# EAGLE design Anatidae (EAGLE 5.11)
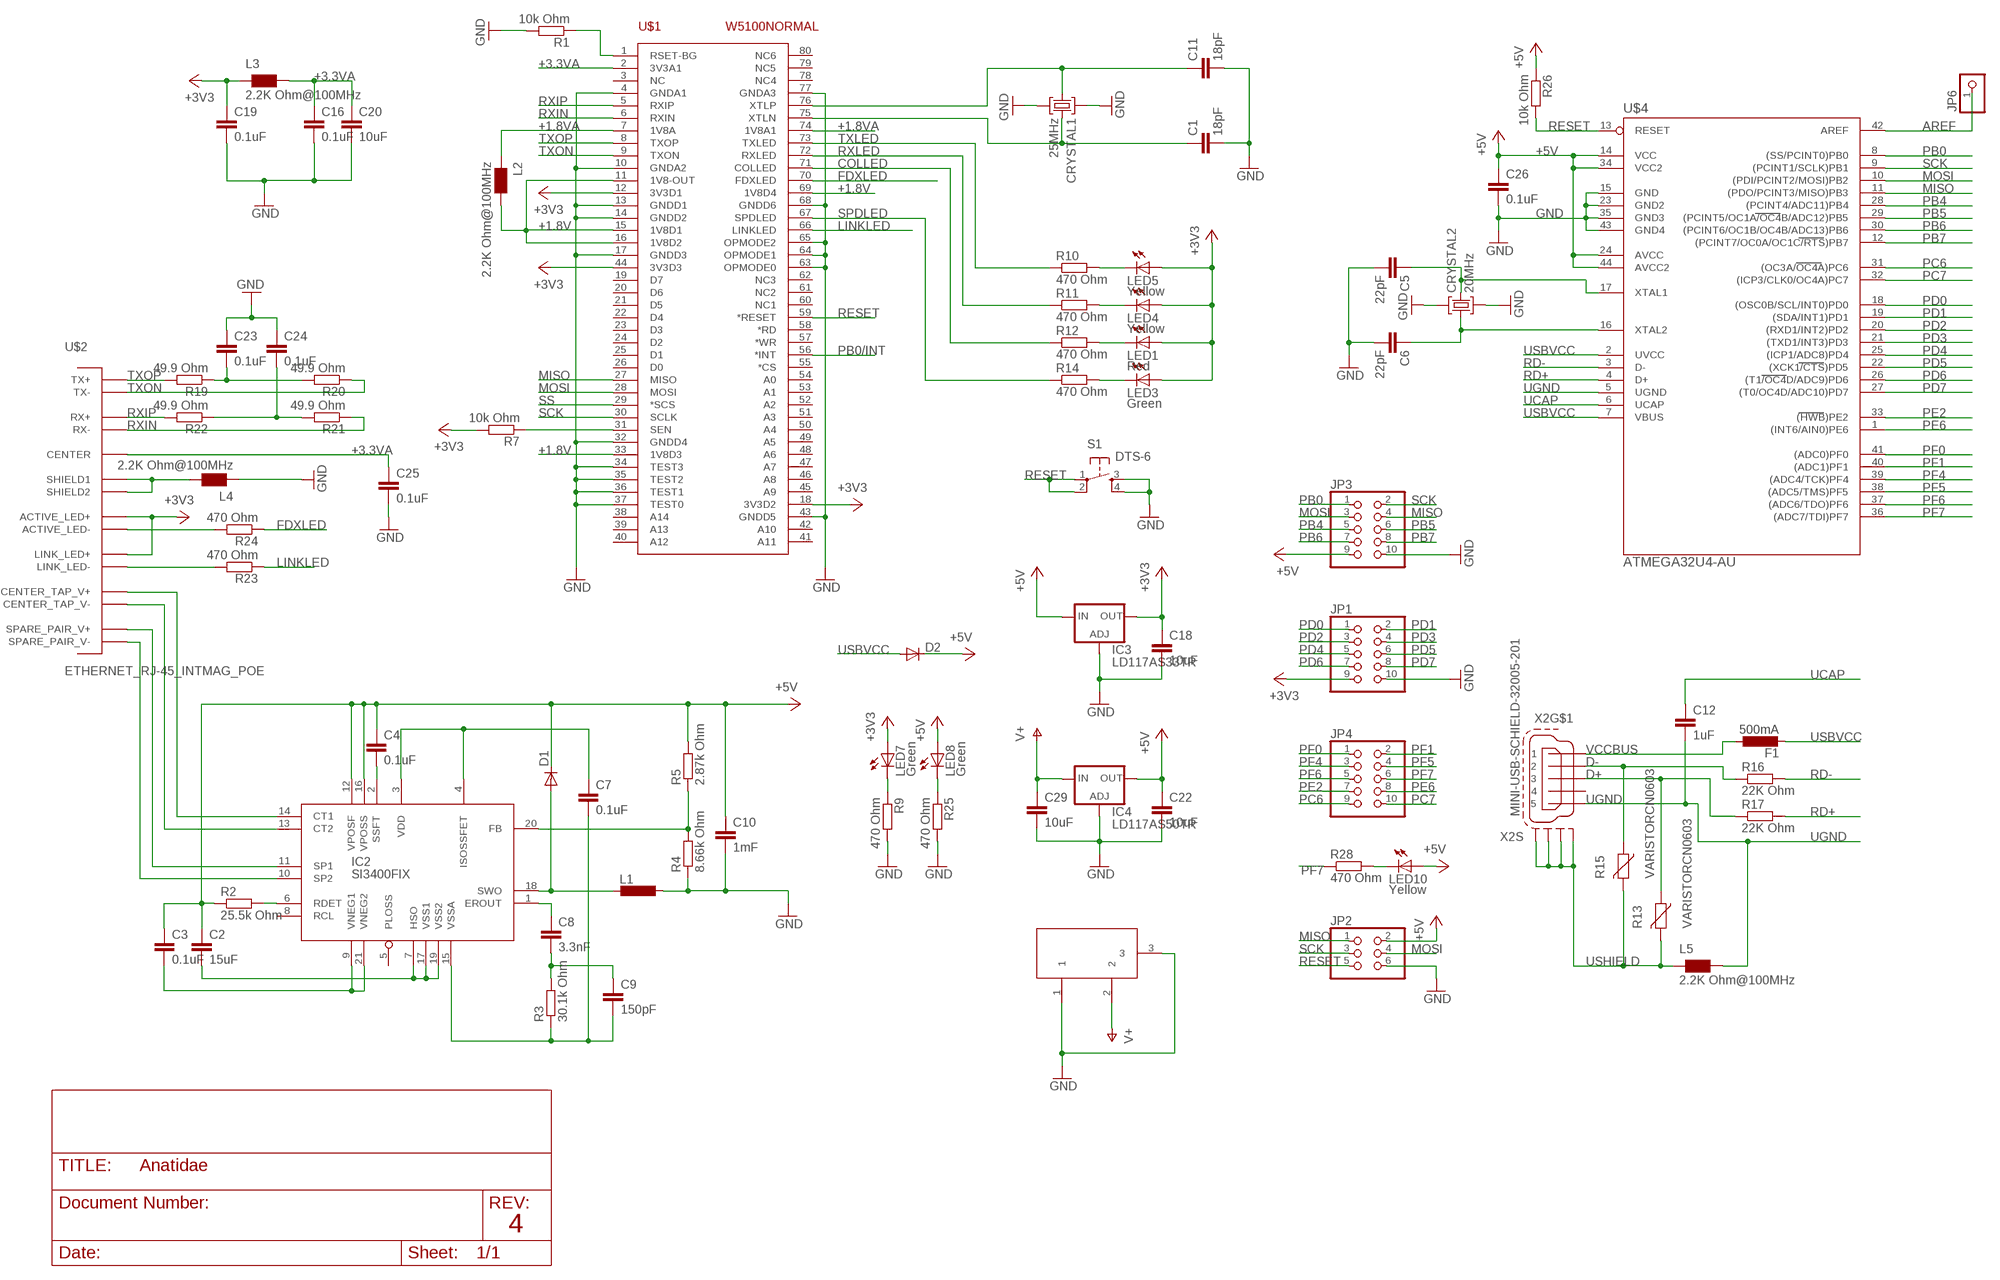
[diagram p0: schematic, sheet 1]

## Parts
C1  18pF  C-EUC0603  [C0603]
C2  15uF  C-EUC0603  [C0603]
C3  0.1uF  C-EUC0603  [C0603]
C4  0.1uF  C-EUC0603  [C0603]
C5  22pF  C-EUC0603  [C0603]
C6  22pF  C-EUC0603  [C0603]
C7  0.1uF  C-EUC0603  [C0603]
C8  3.3nF  C-EUC0603  [C0603]
C9  150pF  C-EUC0603  [C0603]
C10  1mF  C-EUC0603  [C0603]
C11  18pF  C-EUC0603  [C0603]
C12  1uF  C-EUC0603  [C0603]
C16  0.1uF  C-EUC0603  [C0603]
C18  10uF  C-EUC1210  [C1210]
C19  0.1uF  C-EUC0603  [C0603]
C20  10uF  C-EUC1210  [C1210]
C22  10uF  C-EUC1210  [C1210]
C23  0.1uF  C-EUC0603  [C0603]
C24  0.1uF  C-EUC0603  [C0603]
C25  0.1uF  C-EUC0603  [C0603]
C26  0.1uF  C-EUC0603  [C0603]
C29  10uF  C-EUC1210  [C1210]
CRYSTAL1  25MHz  MJ-CRYSTAL  [5032]
CRYSTAL2  20MHz  MJ-CRYSTAL  [5032]
D1  DIODESMA  [SMA-DIODE]
D2  DIODESMA  [SMA-DIODE]
F1  500mA  L-EUL1812  [L1812]
IC2  SI3400FIX  [QFN-20-FIX]
IC3  LD117AS33TR  [SOT223]
IC4  LD117AS50TR  [SOT223]
JP1  PINHD-2X5  [2X05]
JP2  PINHD-2X3  [2X03]
JP3  PINHD-2X5  [2X05]
JP4  PINHD-2X5  [2X05]
JP6  PINHD-1X1  [1X01]
L1  L-EUL1812  [L1812]
L2  2.2K Ohm@100MHz  WE-CBF_0603  [0603]
L3  2.2K Ohm@100MHz  WE-CBF_0603  [0603]
L4  2.2K Ohm@100MHz  WE-CBF_0603  [0603]
L5  2.2K Ohm@100MHz  WE-CBF_0603  [0603]
LED1  Red  LEDCHIP-LED0603  [CHIP-LED0603]
LED3  Green  LEDCHIP-LED0603  [CHIP-LED0603]
LED4  Yellow  LEDCHIP-LED0603  [CHIP-LED0603]
LED5  Yellow  LEDCHIP-LED0603  [CHIP-LED0603]
LED7  Green  LEDCHIP-LED0603  [CHIP-LED0603]
LED8  Green  LEDCHIP-LED0603  [CHIP-LED0603]
LED10  Yellow  LEDCHIP-LED0603  [CHIP-LED0603]
R1  10k Ohm  R-EU_R0603  [R0603]
R2  25.5k Ohm  R-EU_R0603  [R0603]
R3  30.1k Ohm  R-EU_R0603  [R0603]
R4  8.66k Ohm  R-EU_R0603  [R0603]
R5  2.87k Ohm  R-EU_R0603  [R0603]
R7  10k Ohm  R-EU_R0603  [R0603]
R9  470 Ohm  R-EU_R0603  [R0603]
R10  470 Ohm  R-EU_R0603  [R0603]
R11  470 Ohm  R-EU_R0603  [R0603]
R12  470 Ohm  R-EU_R0603  [R0603]
R13  VARISTORCN0603  [CT/CN0603]
R14  470 Ohm  R-EU_R0603  [R0603]
R15  VARISTORCN0603  [CT/CN0603]
R16  22K Ohm  R-EU_R0603  [R0603]
R17  22K Ohm  R-EU_R0603  [R0603]
R19  49.9 Ohm  R-EU_R0603  [R0603]
R20  49.9 Ohm  R-EU_R0603  [R0603]
R21  49.9 Ohm  R-EU_R0603  [R0603]
R22  49.9 Ohm  R-EU_R0603  [R0603]
R23  470 Ohm  R-EU_R0603  [R0603]
R24  470 Ohm  R-EU_R0603  [R0603]
R25  470 Ohm  R-EU_R0603  [R0603]
R26  10k Ohm  R-EU_R0603  [R0603]
R28  470 Ohm  R-EU_R0603  [R0603]
S1  DTS-6  [DTS-6]
U$1  W5100NORMAL  [W5100]
U$2  ETHERNET_RJ-45_INTMAG_POE  [ETHERNET_RJ-45_INTMAG_POE]
U$4  ATMEGA32U4-AU  [TQFP44]
U$6  POWERSUPPLY_DC21MMX  [POWERSUPPLY_DC-21MM]
X2  MINI-USB-SCHIELD-32005-201  [32005-201]

## Nets
+1.8V: L2.2 U$1.11(1V8-OUT) U$1.15(1V8D1) U$1.16(1V8D2) U$1.33(1V8D3) U$1.69(1V8D4)
+1.8VA: L2.1 U$1.7(1V8A) U$1.74(1V8A1)
+3.3VA: C16.1 C20.1 C25.1 L3.2 U$1.2(3V3A1) U$2.CENTER
+3V3: C18.1 C19.1 IC3.4(OUT) JP1.9 L3.1 LED1.A LED3.A LED4.A LED5.A LED7.A R7.2 U$1.12(3V3D1) U$1.18(3V3D2) U$1.44(3V3D3) U$2.ACTIVE_LED+ U$2.LINK_LED+
+5V: C2.1 C3.1 C4.1 C10.1 C22.1 C26.1 D1.C D2.C IC2.12(VPOSF) IC2.16(VPOSS) IC3.3(IN) IC4.4(OUT) JP2.2 JP3.9 LED8.A LED10.A R2.1 R5.2 R26.1 U$4.14(VCC) U$4.24(AVCC) U$4.34(VCC2) U$4.44(AVCC2)
AREF: JP6.1 U$4.42(AREF)
COLLED: R12.1 U$1.71(COLLED)
D+: R13.1 R17.1 X2.3
D-: R15.1 R16.1 X2.2
FDXLED: R24.1 U$1.70(FDXLED)
GND: C1.2 C5.2 C6.2 C10.2 C11.2 C16.2 C18.2 C19.2 C20.2 C22.2 C23.1 C24.1 C25.2 C26.2 C29.2 CRYSTAL1.2-G CRYSTAL1.4-G CRYSTAL2.2-G CRYSTAL2.4-G IC3.1(ADJ) IC4.1(ADJ) JP1.10 JP2.6 JP3.10 L1.1 L4.1 R1.2 R4.1 R9.2 R25.2 S1.3 S1.4 U$1.4(GNDA1) U$1.10(GNDA2) U$1.13(GNDD1) U$1.14(GNDD2) U$1.17(GNDD3) U$1.32(GNDD4) U$1.34(TEST3) U$1.35(TEST2) U$1.36(TEST1) U$1.37(TEST0) U$1.43(GNDD5) U$1.63(OPMODE0) U$1.64(OPMODE1) U$1.65(OPMODE2) U$1.68(GNDD6) U$1.77(GNDA3) U$4.15(GND) U$4.23(GND2) U$4.35(GND3) U$4.43(GND4) U$6.1 U$6.3
LINKLED: R23.1 U$1.66(LINKLED)
MISO: JP2.1 JP3.4 U$1.27(MISO) U$4.11((PDO/PCINT3/MISO)PB3)
MOSI: JP2.4 JP3.3 U$1.28(MOSI) U$4.10((PDI/PCINT2/MOSI)PB2)
N$1: C6.1 CRYSTAL2.1-C U$4.16(XTAL2)
N$2: C5.1 CRYSTAL2.3-C U$4.17(XTAL1)
N$3: IC2.14(CT1) U$2.CENTER_TAP_V+
N$4: IC2.13(CT2) U$2.CENTER_TAP_V-
N$5: IC2.11(SP1) U$2.SPARE_PAIR_V+
N$6: IC2.10(SP2) U$2.SPARE_PAIR_V-
N$7: IC2.6(RDET) R2.2
N$8: R1.1 U$1.1(RSET-BG)
N$9: C3.2 IC2.9(VNEG1) IC2.21(VNEG2)
N$10: C4.2 IC2.2(SSFT)
N$11: C7.1 IC2.3(VDD) IC2.4(ISOSSFET)
N$12: C2.2 IC2.7(HSO) IC2.17(VSS1) IC2.19(VSS2)
N$13: C7.2 C9.2 IC2.15(VSSA) R3.1
N$14: C8.2 C9.1 R3.2
N$15: C8.1 IC2.1(EROUT)
N$16: IC2.20(FB) R4.2 R5.1
N$17: D1.A IC2.18(SWO) L1.2
N$19: C11.1 CRYSTAL1.1-C U$1.76(XTLP)
N$20: C1.1 CRYSTAL1.3-C U$1.75(XTLN)
N$21: LED7.C R9.1
N$22: LED5.C R10.2
N$23: R7.1 U$1.31(SEN)
N$24: LED4.C R11.2
N$25: LED1.C R12.2
N$27: LED3.C R14.2
N$36: L4.2 U$2.SHIELD1 U$2.SHIELD2
N$37: R23.2 U$2.LINK_LED-
N$38: R24.2 U$2.ACTIVE_LED-
N$39: LED8.C R25.1
N$41: C23.2 R19.1 R20.2
N$42: C24.2 R21.2 R22.1
N$59: LED10.C R28.2
PB0: JP3.1 U$4.8((SS/PCINT0)PB0)
PB0/INT: U$1.56(*INT)
PB4: JP3.5 U$4.28((PCINT4/ADC11)PB4)
PB5: JP3.6 U$4.29((PCINT5/OC1A/OC4B/ADC12)PB5)
PB6: JP3.7 U$4.30((PCINT6/OC1B/OC4B/ADC13)PB6)
PB7: JP3.8 U$4.12((PCINT7/OC0A/OC1C/RTS)PB7)
PC6: JP4.9 U$4.31((OC3A/OC4A)PC6)
PC7: JP4.10 U$4.32((ICP3/CLK0/OC4A)PC7)
PD0: JP1.1 U$4.18((OSC0B/SCL/INT0)PD0)
PD1: JP1.2 U$4.19((SDA/INT1)PD1)
PD2: JP1.3 U$4.20((RXD1/INT2)PD2)
PD3: JP1.4 U$4.21((TXD1/INT3)PD3)
PD4: JP1.5 U$4.25((ICP1/ADC8)PD4)
PD5: JP1.6 U$4.22((XCK1/CTS)PD5)
PD6: JP1.7 U$4.26((T1/OC4D/ADC9)PD6)
PD7: JP1.8 U$4.27((T0/OC4D/ADC10)PD7)
PE2: JP4.7 U$4.33((HWB)PE2)
PE6: JP4.8 U$4.1((INT6/AIN0)PE6)
PF0: JP4.1 U$4.41((ADC0)PF0)
PF1: JP4.2 U$4.40((ADC1)PF1)
PF4: JP4.3 U$4.39((ADC4/TCK)PF4)
PF5: JP4.4 U$4.38((ADC5/TMS)PF5)
PF6: JP4.5 U$4.37((ADC6/TDO)PF6)
PF7: JP4.6 R28.1 U$4.36((ADC7/TDI)PF7)
RD+: R17.2 U$4.4(D+)
RD-: R16.2 U$4.3(D-)
RESET: JP2.5 R26.2 S1.1 S1.2 U$1.59(*RESET) U$4.13(RESET)
RXIN: R21.1 U$1.6(RXIN) U$2.RX-
RXIP: R22.2 U$1.5(RXIP) U$2.RX+
RXLED: R11.1 U$1.72(RXLED)
SCK: JP2.3 JP3.2 U$1.30(SCLK) U$4.9((PCINT1/SCLK)PB1)
SPDLED: R14.1 U$1.67(SPDLED)
SS: U$1.29(*SCS)
TXLED: R10.1 U$1.73(TXLED)
TXON: R20.1 U$1.9(TXON) U$2.TX-
TXOP: R19.2 U$1.8(TXOP) U$2.TX+
UCAP: C12.1 U$4.6(UCAP)
UGND: C12.2 L5.2 U$4.5(UGND) X2.5
USBVCC: D2.A F1.2 U$4.2(UVCC) U$4.7(VBUS)
USHIELD: L5.1 R13.2 R15.2 X2.M1(S:S1) X2.M2(S:S2) X2.M3(S:S3) X2.M4(S:S4)
V+: C29.1 IC4.3(IN) U$6.2
VCCBUS: F1.1 X2.1
Unconnected: IC2.5(PLOSS) IC2.8(RCL) U$1.3(NC) U$1.19(D7) U$1.20(D6) U$1.21(D5) U$1.22(D4) U$1.23(D3) U$1.24(D2) U$1.25(D1) U$1.26(D0) U$1.38(A14) U$1.39(A13) U$1.40(A12) U$1.41(A11) U$1.42(A10) U$1.45(A9) U$1.46(A8) U$1.47(A7) U$1.48(A6) U$1.49(A5) U$1.50(A4) U$1.51(A3) U$1.52(A2) U$1.53(A1) U$1.54(A0) U$1.55(*CS) U$1.57(*WR) U$1.58(*RD) U$1.60(NC1) U$1.61(NC2) U$1.62(NC3) U$1.78(NC4) U$1.79(NC5) U$1.80(NC6) X2.4

## Notes on the sheet
- 4

## Library data of the parts
C1-C12 C16 C18-C20 C22-C26 C29 = rcl:C-EU: CAPACITOR, European symbol
CRYSTAL1 CRYSTAL2 = crystals:MJ-CRYSTAL: EURO QUARTZ MJ CRYSTALS 5 x 3.2 x 1.0mm SMD
D1 D2 = SparkFun:DIODE: Diode These are standard reverse protection diodes and small signal diodes. SMA package can handle up to about 1A. SOD-323 can handle about 200mA. What the SOD-323 package when ordering, there are some mfgs out there that are 5-pin packages.
F1 L1 = rcl:L-EU: INDUCTOR, European symbol
IC2 = silabs-eth:SI3400: Si3400 Power-over-Ethernet (PoE)
IC3 IC4 = v-reg:LD117A?*: Low drop fixed and adjustable positive voltage regulators 1 A Source: http://www.st.com/stonline/products/literature/ds/7194/ld1117axx.pdf
JP1 JP3 JP4 = pinhead:PINHD-2X5: PIN HEADER
JP2 = pinhead:PINHD-2X3: PIN HEADER
JP6 = pinhead:PINHD-1X1: PIN HEADER
L2-L5 = wuerth-elektronik:WE-CBF: SMD EMI Suppression Ferrite Beads - excellent anti-EMI properties - low DCR - impedances till 3000 ohms - rated current up to 6 A
LED1 LED3-LED5 LED7 LED8 LED10 = led:LED: LED OSRAM: - CHIPLED LG R971, LG N971, LY N971, LG Q971, LY Q971, LO R971, LY R971 LH N974, LH R974 LS Q976, LO Q976, LY Q976 LO Q996 - Hyper CHIPLED LW Q18S LB Q993, LB Q99A, LB R99A - SideLED LS A670, LO A670, LY A670, LG A670, LP A670 LB A673, LV A673, LT A673, LW A673 LH A674 LY A675 LS A676, LA A676, LO A676, LY A676, LW A676 LS A679, LY A679, LG A679 - Hyper Micro SIDELED® LS Y876, LA Y876, LO Y876, LY Y876 LT Y87S - SmartLED LW L88C, LW L88S LB L89C, LB L89S, LG L890 LS L89K, LO L89K, LY L89K LS L896, LA L896, LO L896, LY L896 - TOPLED LS T670, LO T670, LY T670, LG T670, LP T670 LSG T670, LSP T670, LSY T670, LOP T670, LYG T670 LG T671, LOG T671, LSG T671 LB T673, LV T673, LT T673, LW T673 LH T674 LS T676, LA T676, LO T676, LY T676, LB T676, LH T676, LSB T676, LW T676 LB T67C, LV T67C, LT T67C, LS T67K, LO T67K, LY T67K, LW E67C LS E67B, LA E67B, LO E67B, LY E67B, LB E67C, LV E67C, LT E67C LW T67C LS T679, LY T679, LG T679 LS T770, LO T770, LY T770, LG T770, LP T770 LB T773, LV T773, LT T773, LW T773 LH T774 LS E675, LA E675, LY E675, LS T675 LS T776, LA T776, LO T776, LY T776, LB T776 LHGB T686 LT T68C, LB T68C - Hyper Mini TOPLED® LB M676 - Mini TOPLED Santana® LG M470 LS M47K, LO M47K, LY M47K Source: http://www.osram.convergy.de LUXEON: - LUMILED® LXK2-PW12-R00, LXK2-PW12-S00, LXK2-PW14-U00, LXK2-PW14-V00 LXK2-PM12-R00, LXK2-PM12-S00, LXK2-PM14-U00 LXK2-PE12-Q00, LXK2-PE12-R00, LXK2-PE12-S00, LXK2-PE14-T00, LXK2-PE14-U00 LXK2-PB12-K00, LXK2-PB12-L00, LXK2-PB12-M00, LXK2-PB14-N00, LXK2-PB14-P00, LXK2-PB14-Q00 LXK2-PR12-L00, LXK2-PR12-M00, LXK2-PR14-Q00, LXK2-PR14-R00 LXK2-PD12-Q00, LXK2-PD12-R00, LXK2-PD12-S00 LXK2-PH12-R00, LXK2-PH12-S00 LXK2-PL12-P00, LXK2-PL12-Q00, LXK2-PL12-R00 Source: www.luxeon.com KINGBRIGHT: KA-3528ASYC Source: www.kingbright.com
R1-R5 R7 R9-R12 R14 R16 R17 R19-R26 R28 = rcl:R-EU_: RESISTOR, European symbol
R13 R15 = varistor:VARISTOR: VARISTOR
S1 = switch:DTS-6
U$1 = WIZNET:W5100: W5100 single-chip Internet-enabled 10/100 Ethernet controller The W5100 is a full-featured, single-chip Internet-enabled 10/100 Ethernet controller designed for embedded applications where ease of integration, stability, performance, area and system cost control are required. The W5100 has been designed to facilitate easy implementation of Internet connectivity without OS. The W5100 is IEEE 802.3 10BASE-T and 802.3u 100BASE-TX compliant.
U$2 = connector:ETHERNET_RJ-45_INTMAG_POE: Ethernet Jack with Integrated Magnetics and Power over Ethernet Single RJ-45 "MagJack" with integrated magnetics and LEDs. 10/100 Base with Power over Ethernet.
U$4 = mega32U4:ATMEGA32U4-AU
U$6 = Sparky:POWERSUPPLY_DC21MM
X2 = con-cypressindustries:MINI-USB-SCHIELD-: MINI USB-B Conector Source: www.cypressindustries.com; OC_FARNELL: unknown; OC_NEWARK: unknown

## Board
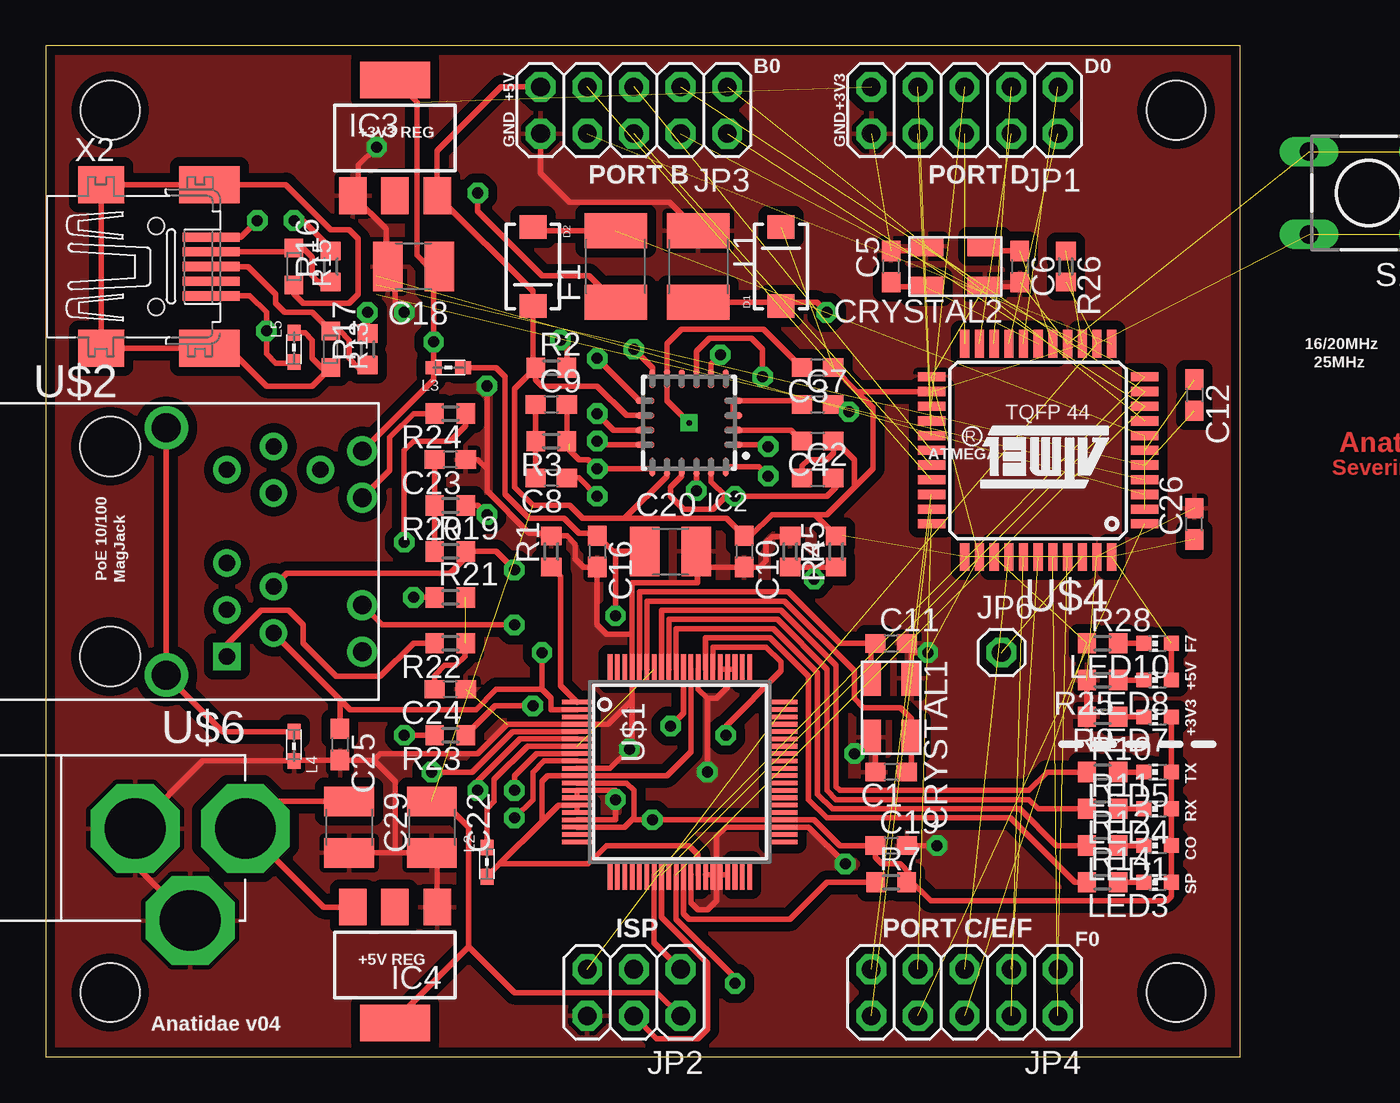
[diagram p1: board, top side]
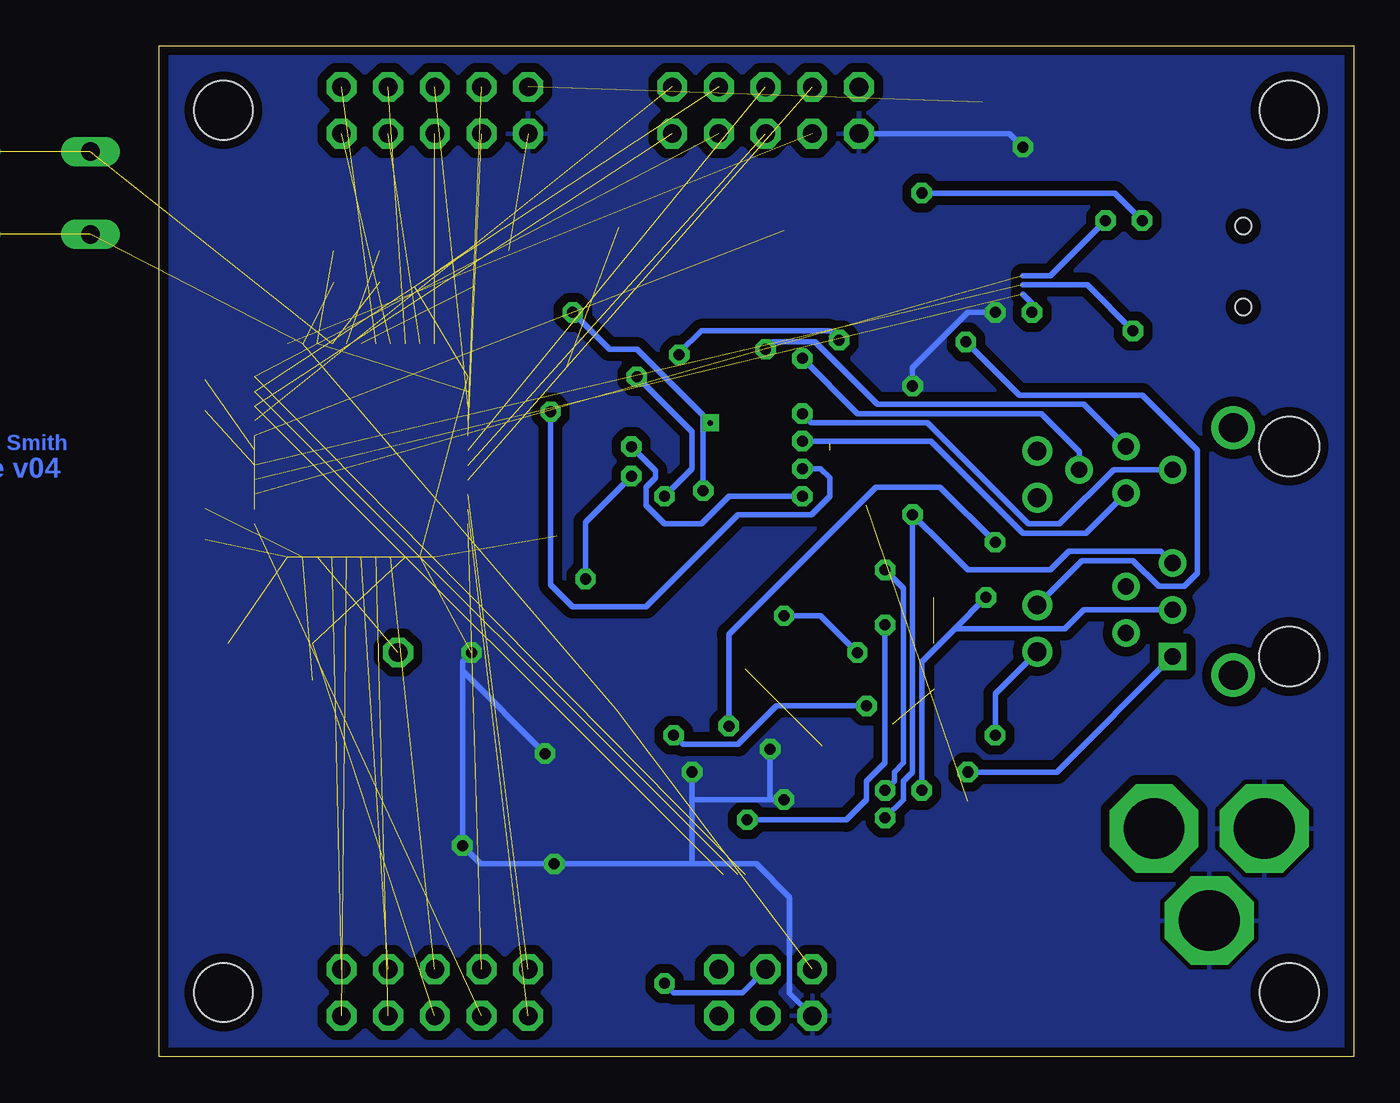
[diagram p2: board, bottom side, seen from below]

Size 65 x 55 mm. Coordinates in mm from the lower left corner, seen from the top.
Outline: 0,0 65,0 65,55 0,55 0,0
Copper layers (1*16): Top 0.035mm / dielectric 1.5mm / Bottom 0.035mm
Design rules "APC": minimum track width 7mil, minimum drill 20mil, track to track 7mil, track to pad 7mil, pad to pad 7mil, via to via 7mil, smd to smd 0mil, copper to edge 8mil, drill to drill 8mil, minimum pad ring 12mil, minimum via ring 10mil, stop-mask expansion 4mil, vias tented up to drill 25mil, thermal gap 10mil
Holes 3.2 mm at 3.5,3.5 3.5,51.5 61.5,51.5 61.5,3.5
tRestrict: area 73.5,18.5 to 76.5,21.5; area 68.2,31 to 80.2,34.5
bRestrict: area 68.2,31 to 80.2,34.5

### Footprints (pad centres in the part's own frame; a part is rotated, then mirrored left to right if it is on the bottom)
C0603 = smd 1.1 x 1: 1 -0.85,0; 2 0.85,0
C1210 = smd 1.6 x 2.7: 1 -1.4,0; 2 1.4,0
5032 = smd 1.9 x 1.1: 1-C -1.6,-1.1; 2-G 1.6,-1.1; 3-C 1.6,1.1; 4-G -1.6,1.1
SMA-DIODE = smd 1.27 x 1.47: A -2.15,0; C 2.15,0
L1812 = smd 1.9 x 3.4: 1 -1.95,0; 2 1.95,0
QFN-20-FIX = smd 1 x 0.35: 1 -2.4,1.2; 2 -2.4,0.4; 3 -2.4,-0.4; 4 -2.4,-1.2; 11 2.4,-1.2; 12 2.4,-0.4; 13 2.4,0.4; 14 2.4,1.2 | smd 0.35 x 1: 5 -2,-2.4; 6 -1.2,-2.4; 7 -0.4,-2.4; 8 0.4,-2.4; 9 1.2,-2.4; 10 2,-2.4; 15 2,2.4; 16 1.2,2.4; 17 0.4,2.4; 18 -0.4,2.4; 19 -1.2,2.4; 20 -2,2.4 | drill 0.3 pad 0.75 square: 21 0,0
SOT223 = smd 1.5 x 2: 1 -2.3,-3.15; 2 0,-3.15; 3 2.3,-3.15 | smd 3.8 x 2: 4 0,3.15
2X05 = drill 1.016 octagon: 1 -5.08,-1.27; 2 -5.08,1.27; 3 -2.54,-1.27; 4 -2.54,1.27; 5 0,-1.27; 6 0,1.27; 7 2.54,-1.27; 8 2.54,1.27; 9 5.08,-1.27; 10 5.08,1.27
2X03 = drill 1.016 octagon: 1 -2.54,-1.27; 2 -2.54,1.27; 3 0,-1.27; 4 0,1.27; 5 2.54,-1.27; 6 2.54,1.27
1X01 = drill 1.016 octagon: 1 0,0
0603 = smd 0.85 x 0.7: 1 -0.9,0; 2 0.7,0
CHIP-LED0603 = smd 0.8 x 0.8: A 0,-0.75; C 0,0.75
R0603 = smd 1 x 1.1: 1 -0.85,0; 2 0.85,0
CT/CN0603 = smd 1 x 1: 1 -1,0; 2 1,0
DTS-6 = drill 1 long: 1 -3.25,2.25; 2 3.25,2.25; 3 -3.25,-2.25; 4 3.25,-2.25
W5100 = smd 0.25 x 1.6: 1 -3.8,-5.6; 2 -3.4,-5.6; 3 -3,-5.6; 4 -2.6,-5.6; 5 -2.2,-5.6; 6 -1.8,-5.6; 7 -1.4,-5.6; 8 -1,-5.6; 9 -0.6,-5.6; 10 -0.2,-5.6; 11 0.2,-5.6; 12 0.6,-5.6; 13 1,-5.6; 14 1.4,-5.6; 15 1.8,-5.6; 16 2.2,-5.6; 17 2.6,-5.6; 18 3,-5.6; 19 3.4,-5.6; 20 3.8,-5.6; 41 3.8,5.6; 42 3.4,5.6; 43 3,5.6; 44 2.6,5.6; 45 2.2,5.6; 46 1.8,5.6; 47 1.4,5.6; 48 1,5.6; 49 0.6,5.6; 50 0.2,5.6; 51 -0.2,5.6; 52 -0.6,5.6; 53 -1,5.6; 54 -1.4,5.6; 55 -1.8,5.6; 56 -2.2,5.6; 57 -2.6,5.6; 58 -3,5.6; 59 -3.4,5.6; 60 -3.8,5.6 | smd 1.6 x 0.25: 21 5.6,-3.8; 22 5.6,-3.4; 23 5.6,-3; 24 5.6,-2.6; 25 5.6,-2.2; 26 5.6,-1.8; 27 5.6,-1.4; 28 5.6,-1; 29 5.6,-0.6; 30 5.6,-0.2; 31 5.6,0.2; 32 5.6,0.6; 33 5.6,1; 34 5.6,1.4; 35 5.6,1.8; 36 5.6,2.2; 37 5.6,2.6; 38 5.6,3; 39 5.6,3.4; 40 5.6,3.8; 61 -5.6,3.8; 62 -5.6,3.4; 63 -5.6,3; 64 -5.6,2.6; 65 -5.6,2.2; 66 -5.6,1.8; 67 -5.6,1.4; 68 -5.6,1; 69 -5.6,0.6; 70 -5.6,0.2; 71 -5.6,-0.2; 72 -5.6,-0.6; 73 -5.6,-1; 74 -5.6,-1.4; 75 -5.6,-1.8; 76 -5.6,-2.2; 77 -5.6,-2.6; 78 -5.6,-3; 79 -5.6,-3.4; 80 -5.6,-3.8
ETHERNET_RJ-45_INTMAG_POE = drill 1.016 round: ACTIVE_LED+ -5.461,13.716; ACTIVE_LED- -2.921,13.716; LINK_LED+ 2.921,13.716; LINK_LED- 5.461,13.716 | drill 0.889 round: CENTER 4.445,8.89; CENTER_TAP_V+ -3.175,8.89; CENTER_TAP_V- -4.445,6.35; RX- 3.175,6.35; SPARE_PAIR_V+ -4.445,11.43; SPARE_PAIR_V- -5.715,8.89; TX+ 1.905,8.89; TX- 0.635,6.35 | drill 0.889 square: RX+ 5.715,6.35 | drill 1.575 round: SHIELD1 -6.731,3.048; SHIELD2 6.731,3.048 | hole 3.251: -5.715,0; 5.715,0
TQFP44 = smd 1.5 x 0.5: 1 -5.8,4; 2 -5.8,3.2; 3 -5.8,2.4; 4 -5.8,1.6; 5 -5.8,0.8; 6 -5.8,0; 7 -5.8,-0.8; 8 -5.8,-1.6; 9 -5.8,-2.4; 10 -5.8,-3.2; 11 -5.8,-4; 23 5.8,-4; 24 5.8,-3.2; 25 5.8,-2.4; 26 5.8,-1.6; 27 5.8,-0.8; 28 5.8,0; 29 5.8,0.8; 30 5.8,1.6; 31 5.8,2.4; 32 5.8,3.2; 33 5.8,4 | smd 0.5 x 1.5: 12 -4,-5.8; 13 -3.2,-5.8; 14 -2.4,-5.8; 15 -1.6,-5.8; 16 -0.8,-5.8; 17 0,-5.8; 18 0.8,-5.8; 19 1.6,-5.8; 20 2.4,-5.8; 21 3.2,-5.8; 22 4,-5.8; 34 4,5.8; 35 3.2,5.8; 36 2.4,5.8; 37 1.6,5.8; 38 0.8,5.8; 39 0,5.8; 40 -0.8,5.8; 41 -1.6,5.8; 42 -2.4,5.8; 43 -3.2,5.8; 44 -4,5.8
POWERSUPPLY_DC-21MM = drill 3.302 pad 4.826 octagon: 1 -5.08,-3.353; 2 -0.076,-6.35; 3 -0.076,-0.356
32005-201 = smd 3.1 x 0.5: 1 3,1.6; 2 3,0.8; 3 3,0; 4 3,-0.8; 5 3,-1.6 | smd 2.5 x 2: M1 -3,-4.45; M2 -3,4.45 | smd 3.3 x 2: M3 2.9,4.45; M4 2.9,-4.45 | hole 0.9: 0,2.2; 0,-2.2

### Placement (x,y rotation side)
C1  46,15.5 180 top
C2  42,31.5 0 top
C3  42,37.5 180 top
C4  42,33.5 180 top
C5  46,43 90 top
C6  53,43 270 top
C7  42,35.5 0 top
C8  27.5,31.5 180 top
C9  27.5,35.5 0 top
C10  38,27.5 270 top
C11  46,22.5 0 top
C12  62.5,36 270 top
C16  30,27.5 270 top
C18  20,43 180 top
C19  46,11.5 0 top
C20  34,27.5 0 top
C22  21,12.5 270 top
C23  22,32.5 180 top
C24  22,20 180 top
C25  16,17 270 top
C26  62.5,29 90 top
C29  16.5,12.5 270 top
CRYSTAL1  46,19 270 top
CRYSTAL2  49.5,43 180 top
D1  40,43 90 top
D2  26.5,43 270 top
F1  31,43 90 top
IC2  35,34.5 180 top
IC3  19,50 0 top
IC4  19,5 180 top
JP1  50,51.5 180 top
JP2  32,3.5 180 top
JP3  32,51.5 180 top
JP4  50,3.5 180 top
JP6  52,22 0 top
L1  35.5,43 270 top
L2  24,10.5 270 top
L3  22,37.5 0 top
L4  13.5,17 90 top
L5  13.5,38.5 270 top
LED1  60.5,11.5 90 top
LED3  60.5,9.5 90 top
LED4  60.5,13.5 90 top
LED5  60.5,15.5 90 top
LED7  60.5,18.5 90 top
LED8  60.5,20.5 90 top
LED10  60.5,22.5 90 top
R1  27.5,27.5 90 top
R2  27.5,37.5 0 top
R3  27.5,33.5 180 top
R4  40.5,27.5 270 top
R5  43,27.5 90 top
R7  46,9.5 0 top
R9  57.5,18.5 180 top
R10  57.5,15.5 0 top
R11  57.5,13.5 0 top
R12  57.5,11.5 0 top
R13  15.5,38.5 270 top
R14  57.5,9.5 0 top
R15  13.5,43 270 top
R16  15.5,43 90 top
R17  17.5,38.5 90 top
R19  22,27.5 0 top
R20  22,30 180 top
R21  22,25 0 top
R22  22,22.5 180 top
R23  22,17.5 180 top
R24  22,35 180 top
R25  57.5,20.5 180 top
R26  55.5,43 270 top
R28  57.5,22.5 0 top
S1  72,47 180 top  (outside the outline)
U$1  34.5,15.5 270 top
U$2  3.5,27.5 270 top
U$4  54,33 180 top
U$6  4.5,12.5 90 top
X2  6,43 0 top

### Tracks (layer width: path | path; a pad name or v marks a point on that pad's centre or on a via)
+1.8V
  Top 0.305: U$1.16 U$1.15 27.9,13.7 27,12.8 | 27,12.8 27,15 27.3,15.3 U$1.11 33.8,15.3 35.1,16.6 U$1.69 | 24.7,10.5 27,12.8 | U$1.33 35.5,11 35,11.5 30.5,11.5 29.5,10.5 24.7,10.5 | L2.2 24.7,10.5
+1.8VA  (1 unrouted)
  Top 0.305: U$1.7 26.2,16.9 24.4,15.1 24.4,13.9 24,13.5 L2.1
+3.3VA  (via drill 0.6)
  Top 0.305: 16,19.45 16.55,18.9 23.4,18.9 24.5,20 27,20 | C25.1 16,19.45 | 16,19.45 U$2.CENTER | 27,20 27.5,19.5 27.5,18.9 U$1.2 | C16.1 30.85,27.5 31,27.5 | 31,27.5 C20.1 | C16.1 29.65,28.35 | C16.1 29.85,28.5 29,28.5 28.2,29.3 26.3,29.3 25,30.6 25,37 24.5,37.5 L3.2 | 27,20 v27,22 | v31,24 31,27.5
  Bottom 0.305: v27,22 29,24 v31,24
+3V3  (via drill 0.6)  (1 unrouted)
  Top 0.305: IC3.4 20.2,51.95 20.2,43.6 20.8,43 | 20.8,43 C18.1 | U$1.12 31.6,14.9 32,14.5 32,13 | 32,13 31.5,12.5 U$1.18 | 32,13 32.1,12.9 v33,12.9 U$1.44 41.8,12.9 43.2,11.5 C19.1 | v25.5,23.5 18.3,23.5 U$2.LINK_LED+ | 20.8,43 21.1,42.7 v21.1,38.9 | U$2.ACTIVE_LED+ 21.1,36.84 L3.1 v21.1,38.9 | v21.1,38.9 | C19.1 45.15,10.85 45.5,10.5 46.5,10.5 47,10 47,9.65 | 47,9.65 R7.2 | C19.1 45,11.65 | 47,9.65 48.15,8.5 61,8.5 61.25,8.75 LED3.A LED1.A LED4.A LED5.A LED7.A
  Bottom 0.305: v25.5,23.5 25.5,16 26.5,15 26.5,14 27.6,12.9 v33,12.9 | v21.1,38.9 18.2,36 11.5,36 8.5,33 8.5,26.3 9.2,25.6 10.6,25.6 12,27 14.79,27 U$2.LINK_LED+
+5V  (8 unrouted)
  Top 0.305: JP3.9 24.77,52.77 21.3,49.3 IC3.3 26.5,41.65 D2.C 26.5,37.65 R2.1 | IC4.4 19,2 23,6 | 23,6 23,12.5 22,13.5 21.4,13.5 C22.1 | R2.1 26.65,36.85 27,36.5 30,36.5 31.6,34.9 IC2.12 | R2.1 25.5,36.35 25.5,31 26.5,30 28.5,30 29.2,29.3 31.5,29.3 | C2.1 41.15,32.15 41.5,32.5 42.5,32.5 42.85,32.85 C4.1 43,33.5 44,32.5 44,31 | 31.5,29.3 37.05,29.3 C10.1 38.35,28.35 39.5,29.5 41.85,29.5 | IC2.16 33.8,31.6 31.5,29.3 | 41.85,29.5 R5.2 43.35,28.35 | 41.85,29.5 42.5,29.5 44,31 | 44.15,36.2 C3.1 | 44.15,36.2 U$4.24 | 44.15,36.2 45,35.35 45,32 44,31 | 23,6 25.5,3.5 33.27,3.5 JP2.2 | LED10.A LED8.A
AREF  (1 unrouted)
COLLED
  Top 0.305: U$1.71 34.3,23.3 39.6,23.3 42,20.9 42,14.3 42.8,13.5 53,13.5 55,11.5 R12.1
D+
  Top 0.305: X2.3 11,43 12.5,41.5 12.5,41 13,40.5 14.5,40.5 R13.1 16,39.5 16.5,39 16.5,38 17,37.5 17.35,37.5 R17.1
D-
  Top 0.305: X2.2 13.3,43.8 R15.1 14,44 14.5,43.5 14.5,42.5 15,42 15.35,42 R16.1
FDXLED  (via drill 0.6)
  Top 0.305: R24.1 22.85,34.35 22,33.5 20,33.5 19.5,33 v19.5,28 | v34,18 34.7,18.7 U$1.70
  Bottom 0.305: v19.5,28 22.5,31 26,31 34,23 v34,18
GND  (via drill 0.6)  (12 unrouted)
  Top 0.305: 18.5,42 18.5,45.05 IC3.1 17,47.15 17,48.5 v18,49.5 | 18.5,42 18.6,42.1 C18.2 | U$6.1 4.86,10.42 U$6.3 8.53,16.1 L4.1 13.55,16.15 C25.2 17.85,16.15 | 19,11.1 C29.2 | 17.85,16.15 19,15 19,11.1 | 17.85,16.15 18.2,16.5 23.5,16.5 25.1,18.1 U$1.4 30.6,18.1 31.9,19.4 U$1.77 | 19,11.1 C22.2 21.3,10.8 IC4.1 | U$1.10 30.7,15.7 v31.75,16.75 31.9,16.9 U$1.77 | U$1.14 U$1.13 31,14.5 v31,14 31,12.9 U$1.17 | 18.5,42 19,42 19,41 v19.5,40.5 | 24,32 23.5,32.5 C23.1 23,32.35 | C20.2 35.4,27 35.45,26.95 | R4.1 40.45,28.3 39.5,28.3 39.2,28 39.2,27 38.85,26.65 C10.2 35.75,26.65 35.45,26.95 | 24,32 24,30.8 26.3,28.5 27.5,28.5 R1.2 28.35,28.35 28.8,27.9 28.8,27.1 29.25,26.65 C16.2 30,23.5 30.5,23 31.9,23 | L1.1 33.95,46.5 28.5,46.5 26.92,48.08 JP3.10 | 24,32 v24,36.5 | C1.2 45.15,17.15 CRYSTAL1.2-G v44,16.5 | 47.1,22 47.1,22.25 C11.2 | 47.1,22 CRYSTAL1.4-G | U$1.37 U$1.36 U$1.35 | U$1.35 U$1.34 | U$1.32 35.1,8.4 35.5,8 36,8 36.5,8.5 36.5,9.7 U$1.35 | U$1.35 36.5,10.1 36.5,12 37,12.5 U$1.43 41.5,12.5 v43.5,10.5 | 47,11.65 C19.2 v48.5,11.5 | U$1.77 31.9,23 | U$1.77 31.9,19.6 | 36,19.5 36.5,19.5 37.1,20.1 U$1.64 | U$1.64 U$1.65 | U$1.64 U$1.63 | U$1.68 35.5,20 36,19.5 | v36,15.5 36,19.5 | 31.9,23 31.9,25.8 35.45,25.8 35.45,26.95 | v48,22 47.1,22 | R9.2 R25.2 | CRYSTAL2.2-G 47.65,43.85 C5.2 | C6.2 52.75,41.9 CRYSTAL2.4-G
  Bottom 0.305: v18,49.5 18.73,50.23 JP3.10 | v19.5,40.5 21,40.5 24,37.5 v24,36.5 | 31.75,14 v31,14 | v31.75,16.75 31.75,14 | JP2.6 30.7,3.47 30.7,8.7 32.5,10.5 36,10.5 | 36,10.5 v43.5,10.5 47.5,10.5 v48.5,11.5 48.5,21 | 36,14 36,10.5 | 36,14 v36,15.5 | 31.75,14 36,14 | v48,22 48.5,21.5 48.5,21 | 48.5,21 v44,16.5
  pour Bottom (isolate 0.5): 0,55 65,55 65,0 0,0
  pour Top (isolate 0.5): 0,55 65,55 65,0 0,0
LINKLED  (via drill 0.6)
  Top 0.305: R23.1 24.45,19.1 v26.5,19.1 | U$1.66 36.3,22.3 39.2,22.3 40,21.5 40,21 37,18 v37,17.5
  Bottom 0.305: v26.5,19.1 31.4,19.1 33.5,17 36.5,17 v37,17.5
MISO  (2 unrouted)
  Top 0.305: U$1.27 33.1,6.21 JP2.1
MOSI  (2 unrouted)
  Top 0.305: U$1.28 33.5,7.6 35.05,6.05 35.8,5.3 36,5.1 36,1.5 35.5,1 33.23,1 JP2.4
N$1  (1 unrouted)
  Top 0.305: CRYSTAL2.1-C 51.35,43.85 C6.1
N$2  (1 unrouted)
  Top 0.305: C5.1 46.25,41.9 CRYSTAL2.3-C
N$3  (via drill 0.6)
  Top 0.305: IC2.14 30.2,33.3 v30,33.5
  Bottom 0.305: U$2.CENTER_TAP_V+ 14.56,28.5 18,28.5 23,33.5 24,33.5 24.5,33.5 v30,33.5
N$4  (via drill 0.6)
  Top 0.305: IC2.13 30.9,34.1 v30,35
  Bottom 0.305: U$2.CENTER_TAP_V- 13.05,31.95 16,29 17.7,29 23.2,34.5 29.5,34.5 v30,35
N$5  (via drill 0.6)
  Top 0.305: IC2.11 32.3,35.7 v30,38
  Bottom 0.305: U$2.SPARE_PAIR_V+ 14.93,32.93 17,35 27,35 v30,38
N$6  (via drill 0.6)
  Top 0.305: IC2.10 33,37.5 v32,38.5
  Bottom 0.305: U$2.SPARE_PAIR_V- 14.68,35.5 25.9,35.5 29.3,38.9 31.6,38.9 v32,38.5
N$7  (via drill 0.6)
  Top 0.305: IC2.6 36.2,37.7 v36.7,38.2 | v28,39 28.35,38.65 R2.2
  Bottom 0.305: v28,39 28.5,39.5 35.5,39.5 36.7,38.3 v36.7,38.2
N$8
  Top 0.305: R1.1 28,26.15 28,20.2 U$1.1
N$9
  Top 0.305: IC2.21 33.8,35.7 IC2.9 33.8,38.8 34.6,39.6 39.05,39.6 C3.2
N$10
  Top 0.305: IC2.2 40.55,34.1 C4.2
N$11
  Top 0.305: C7.1 40.95,35.7 IC2.4 IC2.3
N$12  (via drill 0.6)
  Top 0.305: C2.2 43,31.35 43,31 42.5,30.5 v37.5,30.5 37,30.5 | IC2.17 34.6,31.6 34,31 34,30.5 34.7,29.8 36.3,29.8 37,30.5 | IC2.19 36.2,31.3 37,30.5 | IC2.7 35.4,38.4 36.1,39.1 38.4,39.1 39,38.5 v39,37
  Bottom 0.305: v39,37 36,34 36,32 v37.5,30.5
N$13  (via drill 0.6)  (1 unrouted)
  Top 0.305: C9.2 28.35,34 | 28.35,34 R3.1 | R3.1 28.5,33.5 | 28.35,34 28.5,33.85 | R3.1 28.5,33.35 | 28.5,33 29,32.5 29.5,32.5 v30,32 32.9,32 IC2.15 | C7.2 43.3,35.5 v43.7,35.1
  Bottom 0.305: v43.7,35.1 43.7,25.7 42.5,24.5 38.5,24.5 33.5,29.5 29.5,29.5 28.5,30.5 28.5,31.5 29,32 v30,32
N$14
  Top 0.305: C9.1 R3.2 C8.2
N$15  (via drill 0.6)
  Top 0.305: C8.1 29,31.5 v30,30.5 | IC2.1 39.2,33.3 v39.3,33.2
  Bottom 0.305: v30,30.5 34,30.5 35.5,29 37.5,29 38.5,30 38.5,31 38,31.5 38,31.9 v39.3,33.2
N$16  (via drill 0.6)
  Top 0.305: R4.2 41.8,26.65 | 41.8,26.65 R5.1 | 41.8,26.65 v41.8,26 | IC2.20 38.8,32.1 v39.3,31.6
  Bottom 0.305: v41.8,26 41.8,29.1 v39.3,31.6
N$17  (via drill 0.6)
  Top 0.305: 39.8,41.05 L1.2 | 39.8,41.05 D1.A | IC2.18 v35.4,30.8 | v42.5,40.5 41.95,41.05 39.8,41.05
  Bottom 0.305: v42.5,40.5 40.5,38.5 39,38.5 35.4,34.9 v35.4,30.8
N$19
  Top 0.305: CRYSTAL1.1-C 44.9,22.25 C11.1 43.2,22.5 40.4,25.3 32.3,25.3 U$1.76
N$20
  Top 0.305: CRYSTAL1.3-C 47.1,15.75 C1.1 | U$1.75 32.7,24.8 40.2,24.8 44,21 44,19.5 44.5,19 46.5,19 47.1,18.4 CRYSTAL1.3-C | CRYSTAL1.3-C 47,17.5
N$21
  Top 0.305: R9.1 LED7.C
N$22
  Top 0.305: R10.2 LED5.C
N$23
  Top 0.305: U$1.31 34.7,7.8 35,7.5 40.5,7.5 42.5,9.5 R7.1
N$24
  Top 0.305: R11.2 LED4.C
N$25
  Top 0.305: R12.2 LED1.C
N$27
  Top 0.305: R14.2 LED3.C
N$36
  Top 0.305: U$2.SHIELD1 U$2.SHIELD2 9.62,17.7 L4.2
N$37  (via drill 0.6)
  Top 0.305: v19.5,17.5 R23.2
  Bottom 0.305: U$2.LINK_LED- 19.5,19.75 v19.5,17.5
N$38
  Top 0.305: R24.2 20,35 18.7,33.7 18.7,31.91 U$2.ACTIVE_LED-
N$39
  Top 0.305: R25.1 LED8.C
N$41
  Top 0.305: C23.2 R20.2 R19.1
N$42  (1 unrouted)
  Top 0.305: C24.2 21.15,20.75 21.7,21.3 22.3,21.3 22.8,21.8 22.8,22.45 R22.1
N$59
  Top 0.305: R28.2 LED10.C
PB0  (1 unrouted)
PB4  (1 unrouted)
PB5  (1 unrouted)
PB6  (1 unrouted)
PB7  (1 unrouted)
PC6  (1 unrouted)
PC7  (1 unrouted)
PD0  (1 unrouted)
PD1  (1 unrouted)
PD2  (1 unrouted)
PD3  (1 unrouted)
PD4  (1 unrouted)
PD5  (1 unrouted)
PD6  (1 unrouted)
PD7  (1 unrouted)
PE2  (1 unrouted)
PE6  (1 unrouted)
PF0  (1 unrouted)
PF1  (1 unrouted)
PF4  (1 unrouted)
PF5  (1 unrouted)
PF6  (1 unrouted)
PF7  (2 unrouted)
RD+  (via drill 0.6)  (1 unrouted)
  Top 0.305: R17.2 v17.5,40.5
  Bottom 0.305: v17.5,40.5 17.5,41 18,41.5
RD-  (via drill 0.6)  (1 unrouted)
  Top 0.305: R16.2 15.5,44 14,45.5 v13.5,45.5
  Bottom 0.305: v13.5,45.5 16.5,42.5 18,42.5
RESET  (5 unrouted)
RXIN  (via drill 0.6)
  Top 0.305: U$1.6 25.8,17.3 23.5,15 v23.5,14.5 | v20,25 R21.1
  Bottom 0.305: v23.5,14.5 23.5,21.5 21.7,23.3 | 21.7,23.3 15.7,23.3 14.68,24.32 U$2.RX- | 21.7,23.3 v20,25
RXIP  (via drill 0.6)
  Top 0.305: U$2.RX+ 9.85,22.45 11.7,24.3 13.2,24.3 14,23.5 14,22.5 15.8,20.7 18.2,20.7 20,22.5 R22.2 21,22.5 | U$1.5 25.4,17.7 23.2,15.5 v21,15.5
  Bottom 0.305: v21,15.5 16.14,15.5 U$2.RX+
RXLED
  Top 0.305: U$1.72 33.9,23.8 39.8,23.8 42.5,21.1 42.5,14.5 43,14 53.5,14 54,13.5 R11.1
SCK  (via drill 0.6)  (2 unrouted)
  Top 0.305: U$1.30 34.3,7.5 37.5,4.3 v37.5,4
  Bottom 0.305: JP2.3 33.27,3.5 37,3.5 v37.5,4
SPDLED
  Top 0.305: U$1.67 35.9,22.8 39.4,22.8 41.5,20.7 41.5,14 42.5,13 52.5,13 56,9.5 R14.1
TXLED
  Top 0.305: U$1.73 33.5,24.3 40,24.3 43,21.3 43,14.7 43.2,14.5 53.5,14.5 54.5,15.5 R10.1
TXON  (via drill 0.6)
  Top 0.305: v24,29.5 23.5,30 R20.1 | U$1.9 27.1,16.1 26.5,15.5 26.5,14 v25.5,13
  Bottom 0.305: v25.5,13 24.5,14 24.5,15 24,15.5 v24,29.5 22.25,27.75 22,27.5 21,26.5 16.5,26.5 15.5,27.5 10.48,27.5 U$2.TX-
TXOP  (via drill 0.6)
  Top 0.305: U$1.8 26.7,16.5 25.5,15.3 v25.5,14.5 | v25.5,26.5 24.5,27.5 R19.2 22.85,27.15 22,26.3 13.1,26.3 U$2.TX+
  Bottom 0.305: v25.5,14.5 25,15 25,15.5 24.5,16 24.5,25.5 v25.5,26.5
UCAP  (1 unrouted)
UGND  (via drill 0.6)  (2 unrouted)
  Top 0.305: X2.5 11.1,41.4 12,40.5 v12,39.5 12,38.25 12.5,37.75 13.45,37.75 L5.2 13.3,38
  Bottom 0.305: v12,39.5 14.5,42 18,42
USBVCC  (2 unrouted)
  Top 0.305: D2.A 26.7,44.95 F1.2
USHIELD
  Top 0.305: L5.1 14.1,39.4 14.5,39 14.5,38 15,37.5 R13.2 14.5,36.5 12,36.5 9.95,38.55 X2.M4 X2.M1 X2.M2 X2.M3 13.05,47.45 15.5,45 16.5,45 17,44.5 17,41.5 16.5,41 14,41 13.5,41.5 R15.2
V+
  Top 0.305: C29.1 12.33,13.9 U$6.2 15.12,8.15 IC4.3
VCCBUS  (via drill 0.6)
  Top 0.305: X2.1 10.6,44.6 v11.5,45.5 | v23.5,47 23.5,46 27,42.5 29.55,42.5 F1.1
  Bottom 0.305: v11.5,45.5 13,47 v23.5,47

### Text on the board
Top: Anatidae v04 | Severin Smith
Bottom: Severin Smith | Anatidae v04
_tsilk: B0 | D0 | +5V | +3V3 | +3V3 REG | GND | GND | PORT B | PORT D | 16/20MHz | 25MHz | POE | ATMEGA | PoE 10/100 | MagJack | WIZNET | AREF | F7 | +5V | +3V3 | MISO | GND | TX | RX | CO | SP | ISP | PORT C/E/F | F0 | +5V REG | Anatidae v04